# EAGLE design eTextile_matrix_sensor (EAGLE 7.6.0)
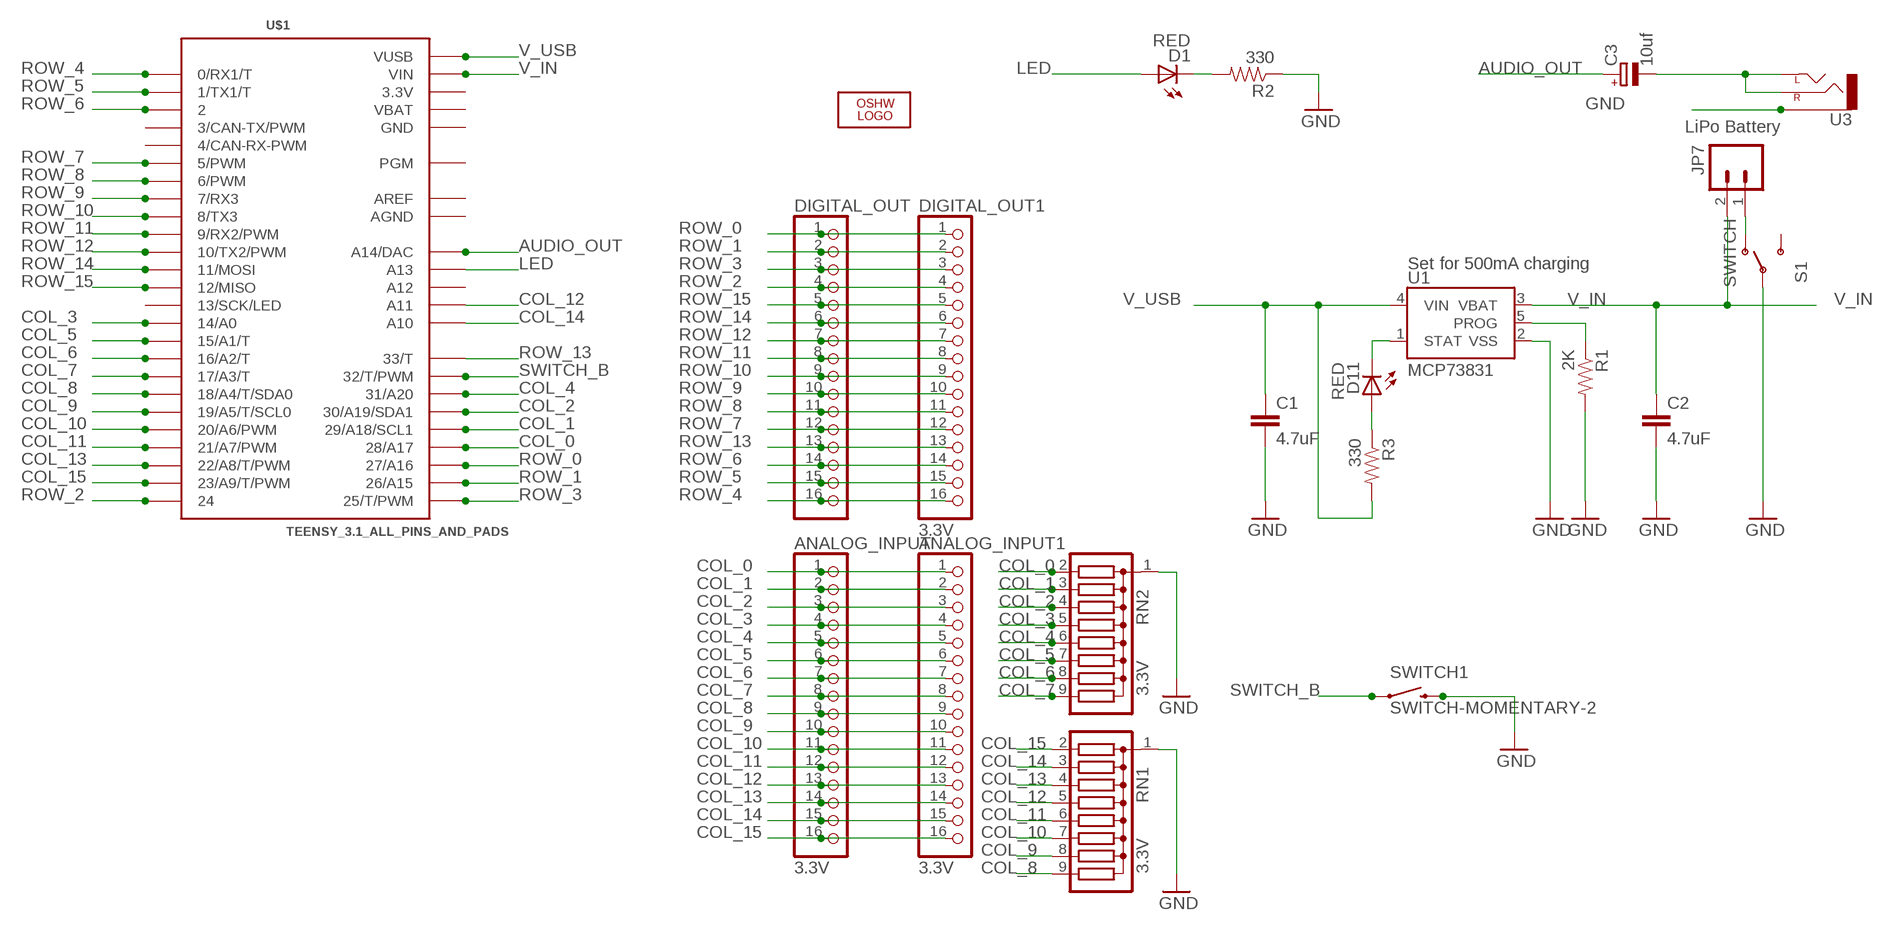
[diagram p0: schematic, sheet 1]

## Parts
ANALOG_INPUT  3.3V  PINHD-1X16/90  [1X16/90]
ANALOG_INPUT1  3.3V  PINHD-1X16  [1X16]
C1  4.7uF  CAP0805  [0805]
C2  4.7uF  CAP0805  [0805]
C3  10uf  CPOL-EUE1.8-4  [E1,8-4]
D1  RED  LED1206  [LED-1206]
D11  RED  LED1206  [LED-1206]
DIGITAL_OUT  PINHD-1X16/90  [1X16/90]
DIGITAL_OUT1  3.3V  PINHD-1X16/90  [1X16/90]
JP7  LiPo Battery  M02-JST-2MM-SMT  [JST-2-SMD]
LOGO1  OSHW_LOGO_8MILX0350-NT  [OSHW_8X350_NOTEXT]
R1  2K  RESISTOR0805-RES  [0805]
R2  330  RESISTOR0805-RES  [0805]
R3  330  RESISTOR0805-RES  [0805]
RN1  3.3V  G08R  [SIL9]
RN2  3.3V  G08R  [SIL9]
S1  SWITCH  SWITCH-SPSTSMD  [AYZ0202]
SWITCH1  SWITCH-MOMENTARY-2  [TACTILE_SWITCH_TALL]
U1  MCP73831  [SOT23-5]
U3  AUDIO-JACKSMD2  [AUDIO-JACK-3.5MM-SMD]
U$1  TEENSY_3.1_ALL_PINS_AND_PADS  [TEENSY_3.1_ALLPINS]

## Nets
AUDIO_OUT: C3.+ U$1.A14(A14/DAC)
COL_0: ANALOG_INPUT1.1 ANALOG_INPUT.1 RN2.2 U$1.28(28/A17)
COL_1: ANALOG_INPUT1.2 ANALOG_INPUT.2 RN2.3 U$1.29(29/A18/SCL1)
COL_2: ANALOG_INPUT1.3 ANALOG_INPUT.3 RN2.4 U$1.30(30/A19/SDA1)
COL_3: ANALOG_INPUT1.4 ANALOG_INPUT.4 RN2.5 U$1.14/A0
COL_4: ANALOG_INPUT1.5 ANALOG_INPUT.5 RN2.6 U$1.31(31/A20)
COL_5: ANALOG_INPUT1.6 ANALOG_INPUT.6 RN2.7 U$1.15/A1(15/A1/T)
COL_6: ANALOG_INPUT1.7 ANALOG_INPUT.7 RN2.8 U$1.16/A2(16/A2/T)
COL_7: ANALOG_INPUT1.8 ANALOG_INPUT.8 RN2.9 U$1.17/A3(17/A3/T)
COL_8: ANALOG_INPUT1.9 ANALOG_INPUT.9 RN1.9 U$1.18/A4(18/A4/T/SDA0)
COL_9: ANALOG_INPUT1.10 ANALOG_INPUT.10 RN1.8 U$1.19/A5(19/A5/T/SCL0)
COL_10: ANALOG_INPUT1.11 ANALOG_INPUT.11 RN1.7 U$1.20/A6(20/A6/PWM)
COL_11: ANALOG_INPUT1.12 ANALOG_INPUT.12 RN1.6 U$1.21/A7(21/A7/PWM)
COL_12: ANALOG_INPUT1.13 ANALOG_INPUT.13 RN1.5 U$1.A11
COL_13: ANALOG_INPUT1.14 ANALOG_INPUT.14 RN1.4 U$1.22/A8(22/A8/T/PWM)
COL_14: ANALOG_INPUT1.15 ANALOG_INPUT.15 RN1.3 U$1.A10
COL_15: ANALOG_INPUT1.16 ANALOG_INPUT.16 RN1.2 U$1.23/A9(23/A9/T/PWM)
GND [gnd_plane]: C1.2 C2.2 R1.2 R2.1 RN1.1 RN2.1 S1.2(P) SWITCH1.B2 U1.2(VSS) U3.SLEEVE
LED: D1.A U$1.A13
N$1: C3.- U3.RING(RIGHT) U3.TIP(LEFT)
N$3: D11.A R3.1
N$4 [gnd_plane]: JP7.1 S1.1(O)
N$5: D1.C R2.2
PROG: R1.1 U1.5(PROG)
ROW_0: DIGITAL_OUT1.1 DIGITAL_OUT.1 U$1.27(27/A16)
ROW_1: DIGITAL_OUT1.2 DIGITAL_OUT.2 U$1.26(26/A15)
ROW_2: DIGITAL_OUT1.4 DIGITAL_OUT.4 U$1.24
ROW_3: DIGITAL_OUT1.3 DIGITAL_OUT.3 U$1.25(25/T/PWM)
ROW_4: DIGITAL_OUT1.16 DIGITAL_OUT.16 U$1.0(0/RX1/T)
ROW_5: DIGITAL_OUT1.15 DIGITAL_OUT.15 U$1.1(1/TX1/T)
ROW_6: DIGITAL_OUT1.14 DIGITAL_OUT.14 U$1.2
ROW_7: DIGITAL_OUT1.12 DIGITAL_OUT.12 U$1.5(5/PWM)
ROW_8: DIGITAL_OUT1.11 DIGITAL_OUT.11 U$1.6(6/PWM)
ROW_9: DIGITAL_OUT1.10 DIGITAL_OUT.10 U$1.7(7/RX3)
ROW_10: DIGITAL_OUT1.9 DIGITAL_OUT.9 U$1.8(8/TX3)
ROW_11: DIGITAL_OUT1.8 DIGITAL_OUT.8 U$1.9(9/RX2/PWM)
ROW_12: DIGITAL_OUT1.7 DIGITAL_OUT.7 U$1.10(10/TX2/PWM)
ROW_13: DIGITAL_OUT1.13 DIGITAL_OUT.13 U$1.33(33/T)
ROW_14: DIGITAL_OUT1.6 DIGITAL_OUT.6 U$1.11(11/MOSI)
ROW_15: DIGITAL_OUT1.5 DIGITAL_OUT.5 U$1.12(12/MISO)
STAT: D11.C U1.1(STAT)
SWITCH_B: SWITCH1.A2 U$1.32(32/T/PWM)
V_IN: C2.1 JP7.2 U1.3(VBAT) U$1.VIN
V_USB: C1.1 R3.2 U1.4(VIN) U$1.VUSB
Unconnected: S1.3(S) U$1.3(3/CAN-TX/PWM) U$1.4(4/CAN-RX-PWM) U$1.13(13/SCK/LED) U$1.A12 U$1.PGM

## Notes on the sheet
- Set for 500mA charging

## Power pins joined to a net without a drawn wire
3.3V: U$1.3.3V U$1.3.3V1(3.3V) U$1.3.3V2(3.3V)
AGND: U$1.AGND
AREF: U$1.AREF
GND: U$1.GND U$1.GND1(GND) U$1.GND2(GND)
VBAT: U$1.VBAT

## Library data of the parts
ANALOG_INPUT ANALOG_INPUT1 DIGITAL_OUT DIGITAL_OUT1 = pinhead:PINHD-1X16: PIN HEADER
C1 C2 = SparkFun:CAP: Capacitor Standard 0603 ceramic capacitor, and 0.1" leaded capacitor.
C3 = rcl:CPOL-EU: POLARIZED CAPACITOR, European symbol
D1 D11 = SparkFun:LED: LEDs Standard schematic elements and footprints for 5mm, 3mm, 1206, and 0603 sized LEDs. 5mm - Spark Fun Electronics SKU : COM-00529 (and others)
JP7 = SparkFun:M02: Header 2 Standard 2-pin 0.1" header. Use with straight break away headers (SKU : PRT-00116), right angle break away headers (PRT-00553), swiss pins (PRT-00743), machine pins (PRT-00117), and female headers (PRT-00115). Molex polarized connector foot print use with SKU : PRT-08233 with associated crimp pins and housings.
LOGO1 = ohw-logo:OSHW_LOGO_8MIL
R1-R3 = SparkFun:RESISTOR: Resistor Basic schematic elements and footprints for 0603, 1206, and PTH resistors.
RN1 RN2 = resistor-sil:G08R: SIL RESISTOR; OC_FARNELL: unknown; OC_NEWARK: unknown
S1 = spark-fun:SWITCH-SPST: SPST Switch Simple slide switch. Spark Fun Electronics SKU : COM-00102
SWITCH1 = SparkFun:SWITCH-MOMENTARY-2
U1 = SparkFun:MCP73831: Microchip's MCP73831 Miniature single cell, fully integrated Li-Ion, Li-polymer charge management controller http://ww1.microchip.com/downloads/en/DeviceDoc/21984a.pdf
U3 = SparkFun:AUDIO-JACK: 3.5mm Audio Jack Simple 3.5mm common PCB mount audio jack. SKU: PRT-08032
U$1 = Teensy_3_Series_Board_v1.0:TEENSY_3.1_ALL_PINS_AND_PADS: Footprint for Teensy 3.1 board using all pads and all through-holes. Pads need a 2x7 0.1" SMD header.

## Net classes
1 power: width 0.203 mm
2 gnd_plane: width 2 mm, drill 0.8 mm, clearance 0.432 mm
4 VDD: width 1 mm, clearance 0.381 mm

## Board
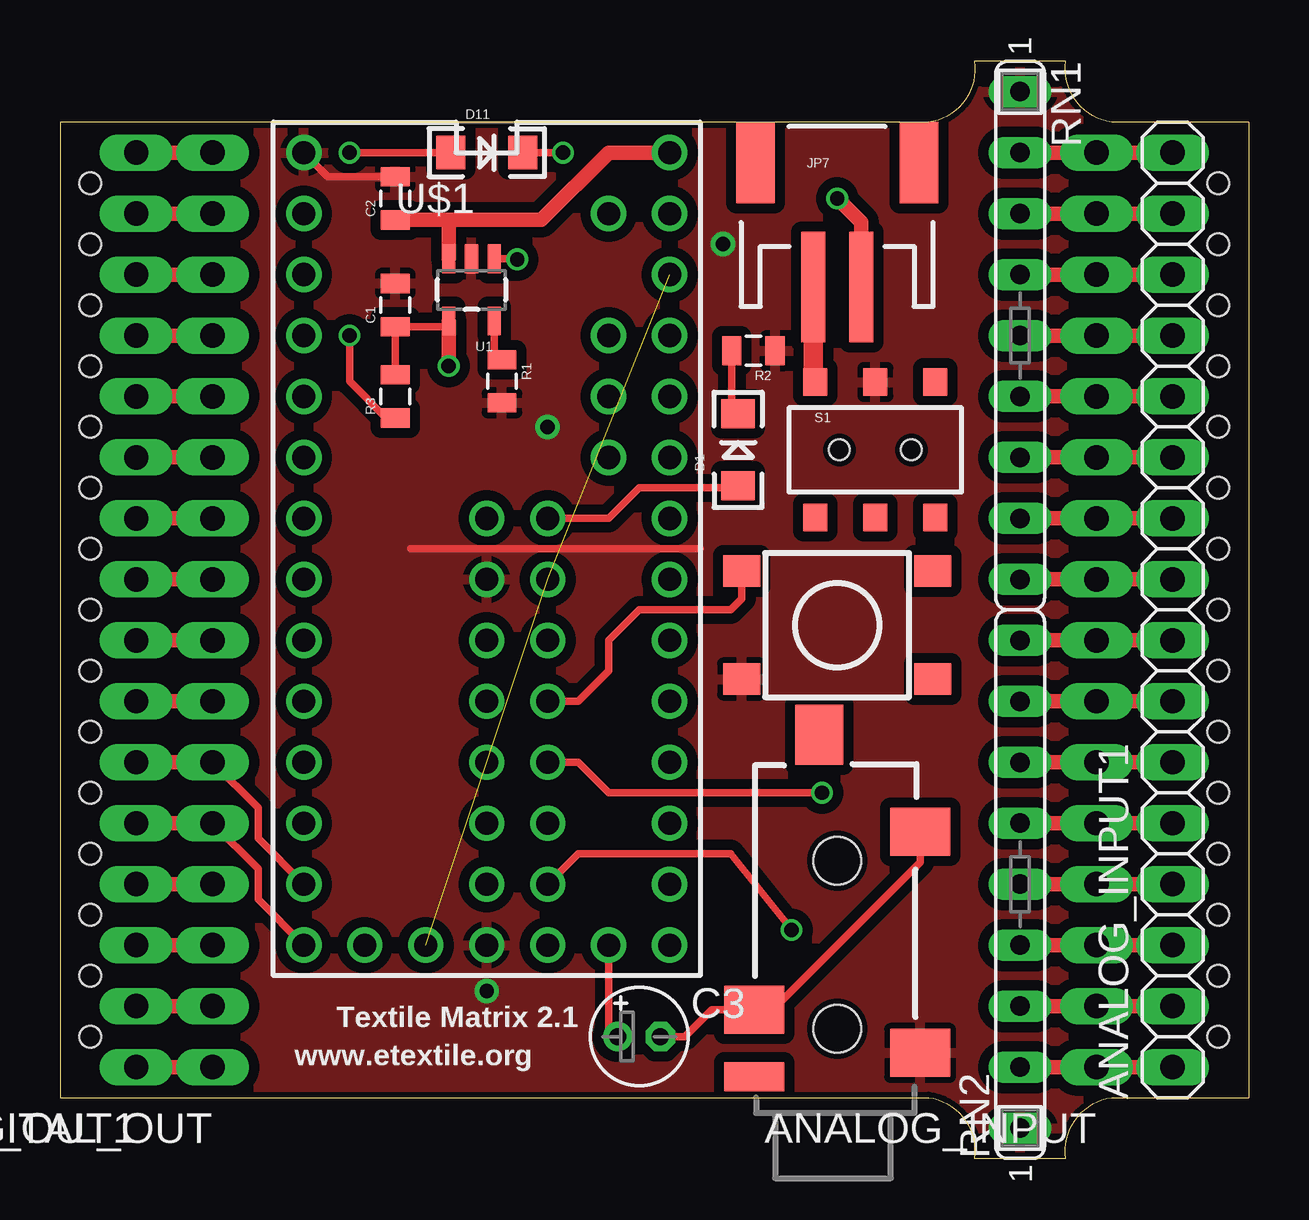
[diagram p1: board, top side]
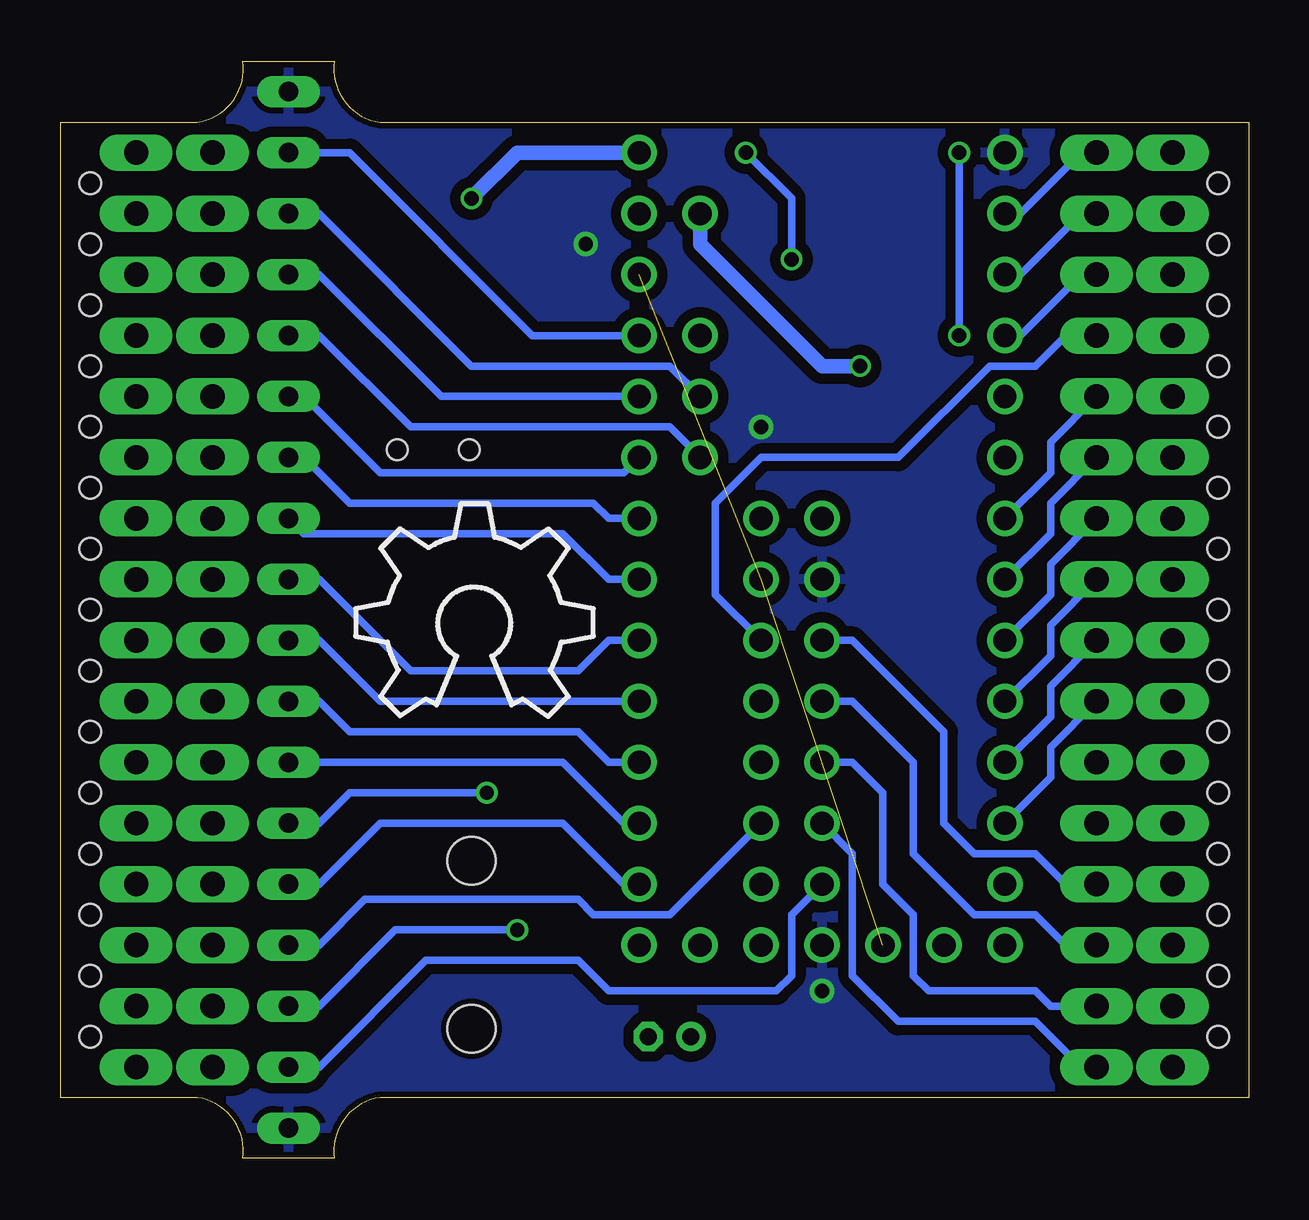
[diagram p2: board, bottom side, seen from below]

Size 49.53 x 45.72 mm. Coordinates in mm from the lower left corner, seen from the top.
Outline: 49.53,43.18 43.81,43.18 arc-90 41.91,45.72 38.1,45.72 arc-90 36.19,43.17 0,43.17 0,2.54 36.2,2.54 arc-90 38.1,0 41.91,0 arc-90 43.81,2.54 49.53,2.54 49.53,43.17
Copper layers (1*16): Top 0.035mm / dielectric 1.5mm / Bottom 0.035mm
Design rules "SeeedStudio_2layer_DRU_no_angle_20140221": minimum track width 6mil, minimum drill 12mil, track to track 6mil, track to pad 6mil, pad to pad 6mil, via to via 6mil, smd to smd 0mil, copper to edge 10mil, drill to drill 10mil, minimum pad ring 10mil, minimum via ring 6mil, stop-mask expansion 2mil, vias tented up to drill 100mil, thermal gap 10mil
Holes 0.9 mm at 1.27,40.64 1.27,38.1 1.27,35.56 1.27,33.02 1.27,30.48 1.27,27.94 1.27,25.4 1.27,20.32 1.27,17.78 1.27,15.24 1.27,12.7 1.27,10.16 1.27,7.62 1.27,5.08 48.26,38.1 48.26,35.56 48.26,33.02 48.26,30.48 48.26,27.94 48.26,25.4 48.26,22.86 48.26,20.32 48.26,17.78 48.26,15.24 48.26,12.7 48.26,10.16 48.26,7.62 48.26,5.08 48.26,40.64 1.27,22.86

### Footprints (pad centres in the part's own frame; a part is rotated, then mirrored left to right if it is on the bottom)
1X16/90 = drill 1.016 long: 1 -19.05,-3.81; 2 -16.51,-3.81; 3 -13.97,-3.81; 4 -11.43,-3.81; 5 -8.89,-3.81; 6 -6.35,-3.81; 7 -3.81,-3.81; 8 -1.27,-3.81; 9 1.27,-3.81; 10 3.81,-3.81; 11 6.35,-3.81; 12 8.89,-3.81; 13 11.43,-3.81; 14 13.97,-3.81; 15 16.51,-3.81; 16 19.05,-3.81
1X16 = drill 1.016 long: 1 -19.05,0; 2 -16.51,0; 3 -13.97,0; 4 -11.43,0; 5 -8.89,0; 6 -6.35,0; 7 -3.81,0; 8 -1.27,0; 9 1.27,0; 10 3.81,0; 11 6.35,0; 12 8.89,0; 13 11.43,0; 14 13.97,0; 15 16.51,0; 16 19.05,0
0805 = smd 0.8 x 1.2: 1 -0.9,0; 2 0.9,0
E1,8-4 = drill 0.711 pad 1.168: + -0.889,0 | drill 0.711 pad 1.168 octagon: - 0.889,0
LED-1206 = smd 1.2 x 1.4: A -1.5,0; C 1.5,0
JST-2-SMD = smd 1 x 4.6: 1 -1,-3.7; 2 1,-3.7 | smd 1.6 x 3.4: NC1 -3.4,1.5; NC2 3.4,1.5
SIL9 = drill 0.813 long: 1 -10.16,0; 2 -7.62,0; 3 -5.08,0; 4 -2.54,0; 5 0,0; 6 2.54,0; 7 5.08,0; 8 7.62,0; 9 10.16,0
AYZ0202 = smd 1 x 1.15: 1 -2.5,2.825; 2 0,2.825; 3 2.5,2.825; 4 -2.5,-2.825; 5 0,-2.825; 6 2.5,-2.825 | hole 0.85: 1.5,0; -1.5,0
TACTILE_SWITCH_TALL = smd 1.55 x 1.3: A1 -3.975,-2.25; A2 3.975,-2.25; B1 -3.975,2.25; B2 3.975,2.25
SOT23-5 = smd 0.55 x 1.2: 1 -0.95,-1.3; 2 0,-1.3; 3 0.95,-1.3; 4 0.95,1.3; 5 -0.95,1.3
AUDIO-JACK-3.5MM-SMD = smd 2 x 2.5: RING 4.3,3.45; SLEEVE 2.5,-3.45; TIP 11.7,-3.45 | smd 1.2 x 2.5: RSH 1.5,3.45 | smd 2.5 x 2: TSH 15.75,0.75 | hole 2: 3.5,0; 10.5,0
TEENSY_3.1_ALLPINS = drill 0.965: 0 -7.62,15.24; 1 -7.62,12.7; 2 -7.62,10.16; 3 -7.62,7.62; 3.3V 7.62,12.7; 3.3V1 -2.54,-15.24; 3.3V2 2.54,0; 4 -7.62,5.08; 5 -7.62,2.54; 6 -7.62,0; 7 -7.62,-2.54; 8 -7.62,-5.08; 9 -7.62,-7.62; 10 -7.62,-10.16; 11 -7.62,-12.7; 12 -7.62,-15.24; 13 7.62,-15.24; 14/A0 7.62,-12.7; 15/A1 7.62,-10.16; 16/A2 7.62,-7.62; 17/A3 7.62,-5.08; 18/A4 7.62,-2.54; 19/A5 7.62,0; 20/A6 7.62,2.54; 21/A7 7.62,5.08; 22/A8 7.62,7.62; 23/A9 7.62,10.16; 24 0,-2.54; 25 0,-5.08; 26 0,-7.62; 27 0,-10.16; 28 0,-12.7; 29 2.54,-12.7; 30 2.54,-10.16; 31 2.54,-7.62; 32 2.54,-5.08; 33 2.54,-2.54; A10 5.08,7.62; A11 5.08,5.08; A12 0,2.54; A13 2.54,2.54; A14 5.08,-15.24; AGND 7.62,15.24; AREF 5.08,10.16; GND -7.62,17.78; GND1 0,-15.24; GND2 0,0; PGM 2.54,-15.24; VBAT -5.08,-15.24; VIN 7.62,17.78; VUSB 5.08,15.24

### Placement (x,y rotation side)
ANALOG_INPUT  39.37,22.86 90 top
ANALOG_INPUT1  46.35,22.86 90 top
C1  13.97,35.56 90 top
C2  13.97,40.01 90 top
C3  24.13,5.08 0 top
D1  28.26,29.53 90 top
D11  17.78,41.91 0 top
DIGITAL_OUT  2.54,22.86 90 top
DIGITAL_OUT1  -0.63,22.86 90 top
JP7  32.38,40.01 0 top
LOGO1  27.3,18.41 0 top
R1  18.41,32.38 270 top
R2  28.89,33.66 180 top
R3  13.97,31.75 90 top
RN1  40.01,34.29 270 top
RN2  40.01,11.43 90 top
S1  33.97,29.53 0 top
SWITCH1  32.38,22.22 180 top
U1  17.14,36.2 180 top
U3  32.38,1.91 90 top
U$1  17.78,24.13 0 top

### Tracks (layer width: path | path; a pad name or v marks a point on that pad's centre or on a via)
3.3V  (2 unrouted)
AUDIO_OUT
  Top 0.305: U$1.A14 22.86,5.46 C3.+
COL_0
  Top 0.61: ANALOG_INPUT1.1 ANALOG_INPUT.1 RN2.2
  Bottom 0.305: U$1.28 19.05,10.16 19.05,7.62 19.68,6.98 26.67,6.98 27.94,8.26 34.29,8.26 38.73,3.81 RN2.2
COL_1  (via drill 0.6)
  Top 0.305: v30.48,9.53 27.94,12.7 21.59,12.7 U$1.29
  Top 0.61: ANALOG_INPUT1.2 ANALOG_INPUT.2 RN2.3
  Bottom 0.305: v30.48,9.53 35.56,9.53 38.73,6.35 RN2.3
COL_2
  Top 0.61: ANALOG_INPUT1.3 ANALOG_INPUT.3 RN2.4
  Bottom 0.305: U$1.30 24.13,10.16 27.3,10.16 27.94,10.79 36.83,10.79 38.73,8.89 RN2.4
COL_3
  Top 0.61: ANALOG_INPUT1.4 ANALOG_INPUT.4 RN2.5
  Bottom 0.305: U$1.14/A0 26.03,11.43 28.58,13.97 36.2,13.97 38.73,11.43 RN2.5
COL_4  (via drill 0.6)
  Top 0.305: U$1.31 21.59,16.51 22.86,15.24 v31.75,15.24
  Top 0.61: ANALOG_INPUT1.5 ANALOG_INPUT.5 RN2.6
  Bottom 0.305: v31.75,15.24 37.46,15.24 38.73,13.97 RN2.6
COL_5
  Top 0.61: ANALOG_INPUT1.6 ANALOG_INPUT.6 RN2.7
  Bottom 0.305: U$1.15/A1 26.03,13.97 28.58,16.51 RN2.7
COL_6
  Top 0.61: ANALOG_INPUT1.7 ANALOG_INPUT.7 RN2.8
  Bottom 0.305: U$1.16/A2 26.67,16.51 27.94,17.78 37.46,17.78 38.73,19.05 RN2.8
COL_7
  Top 0.61: ANALOG_INPUT1.8 ANALOG_INPUT.8 RN2.9
  Bottom 0.305: U$1.17/A3 36.2,19.05 38.73,21.59 RN2.9
COL_8
  Top 0.61: ANALOG_INPUT1.9 ANALOG_INPUT.9 RN1.9
  Bottom 0.305: U$1.18/A4 26.67,21.59 27.94,20.32 34.92,20.32 38.73,24.13 RN1.9
COL_9
  Top 0.61: ANALOG_INPUT1.10 ANALOG_INPUT.10 RN1.8
  Bottom 0.305: U$1.19/A5 26.67,24.13 28.58,26.04 39.37,26.04 RN1.8
COL_10
  Top 0.61: ANALOG_INPUT1.11 ANALOG_INPUT.11 RN1.7
  Bottom 0.305: U$1.20/A6 26.67,26.67 27.3,27.3 37.46,27.3 39.37,29.21 RN1.7
COL_11
  Top 0.61: ANALOG_INPUT1.12 ANALOG_INPUT.12 RN1.6
  Bottom 0.305: RN1.6 39.37,31.75 36.2,28.57 26.03,28.57 U$1.21/A7
COL_12
  Top 0.61: ANALOG_INPUT1.13 ANALOG_INPUT.13 RN1.5
  Bottom 0.305: U$1.A11 24.13,30.48 34.92,30.48 38.73,34.29 RN1.5
COL_13
  Top 0.61: ANALOG_INPUT1.14 ANALOG_INPUT.14 RN1.4
  Bottom 0.305: U$1.22/A8 33.66,31.75 38.73,36.83 RN1.4
COL_14
  Top 0.61: ANALOG_INPUT1.15 ANALOG_INPUT.15 RN1.3
  Bottom 0.305: U$1.A10 24.13,33.02 32.38,33.02 38.73,39.37 RN1.3
COL_15
  Top 0.61: ANALOG_INPUT1.16 ANALOG_INPUT.16 RN1.2
  Bottom 0.305: U$1.23/A9 29.84,34.29 37.46,41.91 RN1.2
GND  (via drill 0.6 pad 1.02)
  Top 0.305: U$1.GND 11.16,40.91 C2.2 | 14.61,25.4 26.67,25.4
  other vias: 17.78,6.98 27.62,38.1 20.32,30.48
  pour Top: 0,45.72 49.53,45.72 49.53,0 0,0
  pour Bottom: 49.53,45.72 49.53,0 0,0 0,45.72
LED
  Top 0.305: U$1.A13 22.86,26.67 24.13,27.94 28.17,27.94 D1.A
N$1
  Top 0.305: C3.- 26.03,5.08 27.16,6.21 U3.RING 29.7,6.21 35.84,12.34 U3.TIP
N$3  (via drill 0.6)
  Top 0.305: D11.A v12.06,41.91 | v12.06,34.29 12.06,32.38 13.6,30.85 R3.1
  Bottom 0.305: v12.06,41.91 v12.06,34.29
N$4
  Top 0.813: JP7.1 31.38,32.44 S1.1
N$5
  Top 0.305: R2.2 27.99,31.29 D1.C
PROG
  Top 0.305: U1.5 18.09,33.61 R1.1
ROW_0
  Top 0.61: DIGITAL_OUT.1 DIGITAL_OUT1.1
  Bottom 0.305: U$1.27 16.51,12.7 16.51,7.62 14.61,5.71 8.89,5.71 6.98,3.81 DIGITAL_OUT.1
ROW_1
  Top 0.61: DIGITAL_OUT.2 DIGITAL_OUT1.2
  Bottom 0.305: U$1.26 16.51,16.51 15.24,15.24 15.24,11.43 13.97,10.16 13.97,7.62 13.34,6.98 8.89,6.98 8.25,6.35 DIGITAL_OUT.2
ROW_2
  Top 0.61: DIGITAL_OUT.4 DIGITAL_OUT1.4
  Bottom 0.305: DIGITAL_OUT.4 7.62,11.43 8.89,12.7 11.43,12.7 12.7,13.97 12.7,17.78 16.51,21.59 U$1.24
ROW_3
  Top 0.61: DIGITAL_OUT.3 DIGITAL_OUT1.3
  Bottom 0.305: DIGITAL_OUT.3 7.62,8.89 8.89,10.16 11.43,10.16 13.97,12.7 13.97,16.51 16.51,19.05 U$1.25
ROW_4
  Top 0.61: DIGITAL_OUT.16 DIGITAL_OUT1.16
  Bottom 0.305: DIGITAL_OUT.16 6.98,41.91 9.52,39.37 U$1.0
ROW_5
  Top 0.61: DIGITAL_OUT.15 DIGITAL_OUT1.15
  Bottom 0.305: DIGITAL_OUT.15 6.98,39.37 9.52,36.83 U$1.1
ROW_6
  Top 0.61: DIGITAL_OUT.14 DIGITAL_OUT1.14
  Bottom 0.305: DIGITAL_OUT.14 6.98,36.83 9.52,34.29 U$1.2
ROW_7
  Top 0.61: DIGITAL_OUT.12 DIGITAL_OUT1.12
  Bottom 0.305: DIGITAL_OUT.12 8.25,29.84 8.25,28.57 U$1.5
ROW_8
  Top 0.61: DIGITAL_OUT.11 DIGITAL_OUT1.11
  Bottom 0.305: DIGITAL_OUT.11 8.25,27.3 8.25,26.04 U$1.6
ROW_9
  Top 0.61: DIGITAL_OUT.10 DIGITAL_OUT1.10
  Bottom 0.305: DIGITAL_OUT.10 8.25,24.77 8.25,23.5 U$1.7
ROW_10
  Top 0.61: DIGITAL_OUT.9 DIGITAL_OUT1.9
  Bottom 0.305: DIGITAL_OUT.9 8.25,22.22 8.25,20.95 U$1.8
ROW_11
  Top 0.61: DIGITAL_OUT.8 DIGITAL_OUT1.8
  Bottom 0.305: DIGITAL_OUT.8 8.25,19.68 8.25,18.41 U$1.9
ROW_12
  Top 0.61: DIGITAL_OUT.7 DIGITAL_OUT1.7
  Bottom 0.305: DIGITAL_OUT.7 8.25,17.14 8.25,15.88 U$1.10
ROW_13
  Top 0.61: DIGITAL_OUT.13 DIGITAL_OUT1.13
  Bottom 0.305: DIGITAL_OUT.13 7.62,34.29 8.89,33.02 10.79,33.02 14.61,29.21 20.32,29.21 22.22,27.3 22.22,23.5 U$1.33
ROW_14
  Top 0.305: DIGITAL_OUT.6 8.25,14.61 8.25,13.33 U$1.11
  Top 0.61: DIGITAL_OUT.6 DIGITAL_OUT1.6
ROW_15
  Top 0.305: DIGITAL_OUT.5 8.25,12.06 8.25,10.79 U$1.12
  Top 0.61: DIGITAL_OUT.5 DIGITAL_OUT1.5
STAT  (via drill 0.6)
  Top 0.305: U1.1 19.02,37.5 v19.05,37.47 | v20.95,41.91 D11.C
  Bottom 0.305: v19.05,37.47 19.05,40.01 v20.95,41.91
SWITCH_B
  Top 0.305: U$1.32 21.59,19.05 22.86,20.32 22.86,21.59 24.13,22.86 27.94,22.86 28.41,23.33 SWITCH1.A2
V_IN  (via drill 0.6)
  Top 0.61: U$1.VIN 22.86,41.91 20.05,39.11 16.2,39.11 | C2.1 16.2,39.11 | U1.3 16.2,39.11 | JP7.2 33.38,39.01 v32.38,40.01
  Bottom 0.61: v32.38,40.01 30.48,41.91 U$1.VIN
V_USB  (via drill 0.6)
  Top 0.305: R3.2 C1.1 16.2,34.66 U1.4
  Top 0.61: U1.4 v16.2,33.02
  Bottom 0.61: v16.2,33.02 17.78,33.02 22.86,38.1 U$1.VUSB

### Text on the board
_tsilk: Textile Matrix 2.1 | www.etextile.org